# Altium schematic sheet Hierarchy.SchDoc
size A; SheetNumber: 1; SheetTotal: 4
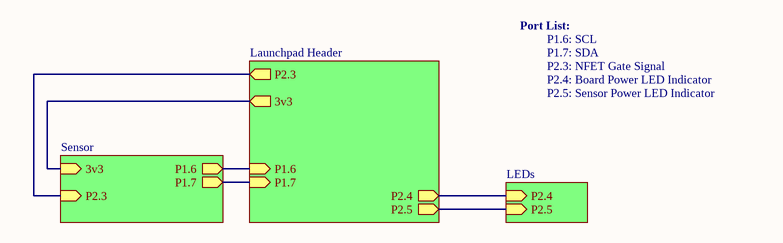
[diagram p0: Hierarchy.SchDoc]

## Sub-sheets
? = Launchpad Header: 3v3 (out), P2.3 (out), P2.4 (out), P2.5 (out), P1.6 (in), P1.7 (in)
? = LEDs: P2.4 (in), P2.5 (in)
? = Sensor: 3v3 (in), P1.7 (out), P1.6 (out), P2.3 (in)

## Nets
(unnamed): sheet /3v3, sheet /3v3
(unnamed): sheet /P2.3, sheet /P2.3
(unnamed): sheet /P2.4, sheet /P2.4
(unnamed): sheet /P2.5, sheet /P2.5
(unnamed): sheet /P1.6, sheet /P1.6
(unnamed): sheet /P1.7, sheet /P1.7

## Notes on the sheet
- Port List:
- P1.6: SCL
- P1.7: SDA
- P2.3: NFET Gate Signal
- P2.4: Board Power LED Indicator
- P2.5: Sensor Power LED Indicator